# Altium project Board_Scale.PrjPcb
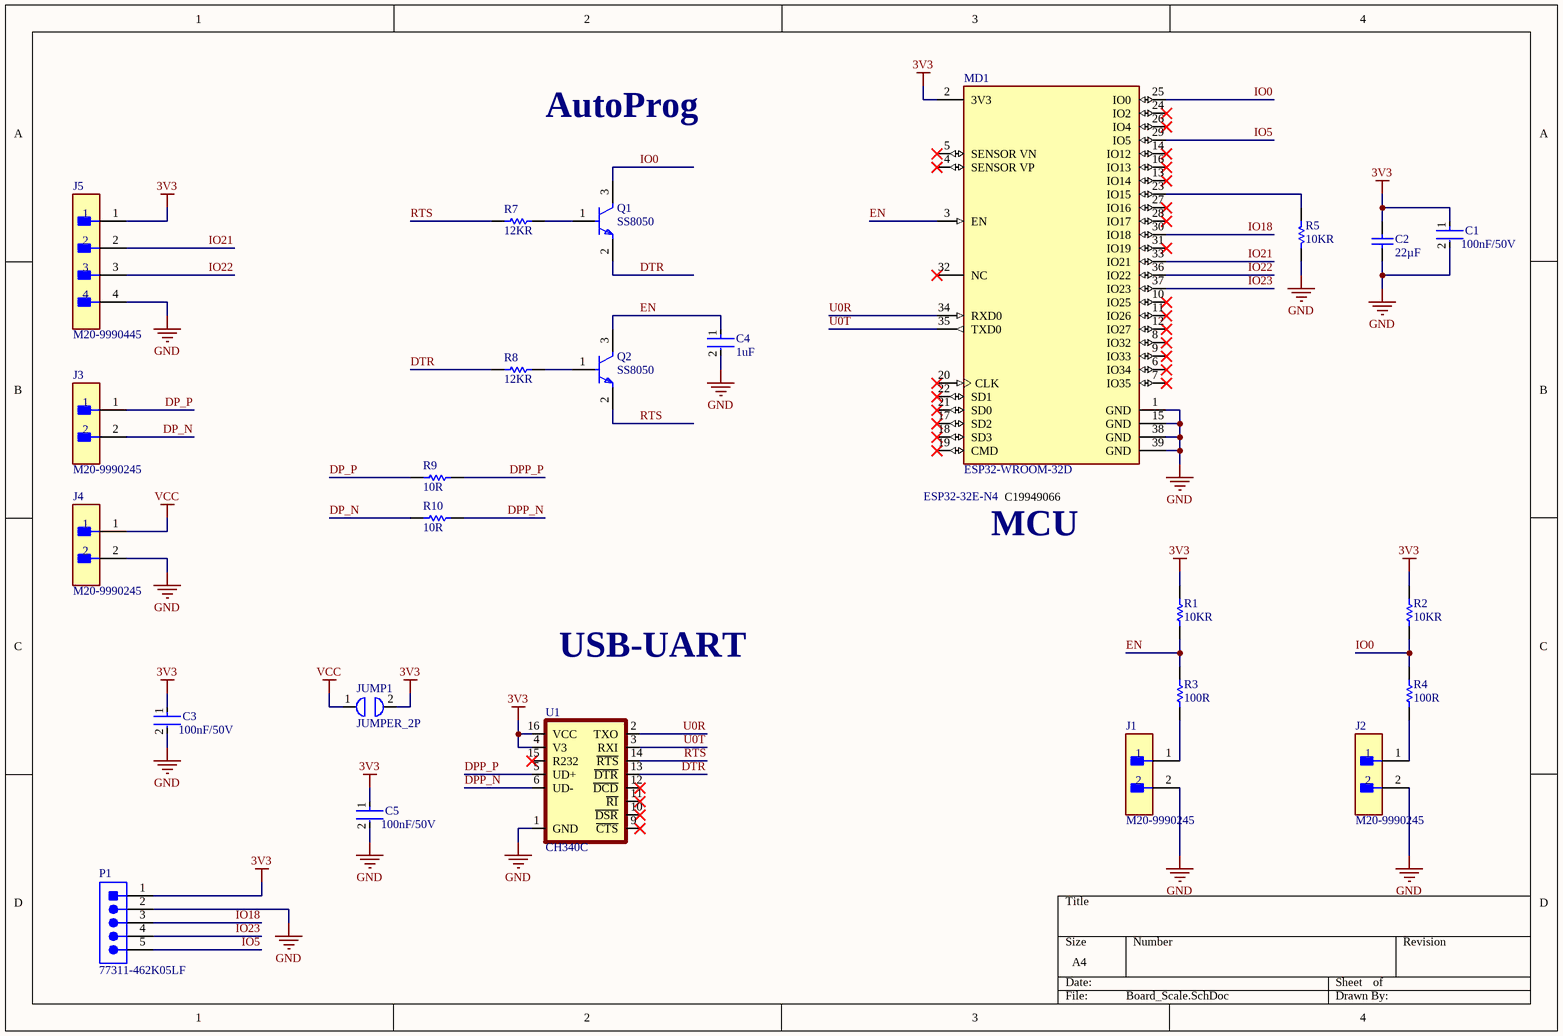
[diagram p0: Board_Scale.SchDoc]
1 sheet, 25 parts. Net scope: global (net labels, ports and power ports of the same name join across sheets).
Board file: Board_Scale.PcbDoc

## Sheet Board_Scale.SchDoc
size A4; SheetNumber: 1; SheetTotal: 1

### Parts
C1  100nF/50V  [FP-CC0603-DA-MFG]
C2  Capacitance: 22µF  [CAPC2013X140X45LL15T25]  (hidden comment: CL21A226MAQNNNE)
C3  100nF/50V  [FP-CC0603-DA-MFG]
C4  1uF  [FP-CL10-IPC_A]
C5  100nF/50V  [FP-CC0603-DA-MFG]
J1  M20-9990245  [FP-M20-9990245-MFG]
J2  M20-9990245  [FP-M20-9990245-MFG]
J3  M20-9990245  [FP-M20-9990245-MFG]
J4  M20-9990245  [FP-M20-9990245-MFG]
J5  M20-9990445  [FP-M20-9990445-MFG]
JUMP1  JUMPER_2P  [JUMPER_2P]
MD1  ESP32-WROOM-32D  [FP-ESP32-WROOM-32D-MFG]
P1  77311-462K05LF  [FCI-77311-5_V]
Q1  SS8050  [FP-SS8050-G-MFG]
Q2  SS8050  [FP-SS8050-G-MFG]
R1  10KR  [RESC1609X55X30LL15T15]
R2  10KR  [RESC1609X55X30LL15T15]
R3  100R  [RESC1608X55X30LL15T15]
R4  100R  [RESC1608X55X30LL15T15]
R5  10KR  [RESC1609X55X30LL15T15]
R7  12KR  [RESC1608X55X25NL10T15]
R8  12KR  [RESC1608X55X25NL10T15]
R9  10R  [RESC1608X55X25NL10T15]
R10  10R  [RESC1608X55X25NL10T15]
U1  CH340C  [SO016]

### Nets
3V3: C1.1 C2.2 C3.1 C5.1 J5.1 JUMP1.2 MD1.2(3V3) P1.1(DTR) R1.1 R2.1 U1.4(V3) U1.16(VCC)
GND: C1.2 C2.1 C3.2 C4.2 C5.2 J1.2 J2.2 J4.2 J5.4 MD1.1(GND) MD1.15(GND) MD1.38(GND) MD1.39(GND) P1.2(RXI) R5.2 U1.1(GND)
VCC: J4.1 JUMP1.1
DP_N: J3.2 R10.2
DP_P: J3.1 R9.2
DPP_N: R10.1 U1.6(UD-)
DPP_P: R9.1 U1.5(UD+)
DTR: Q1.2(E) R8.1 U1.13(~{DTR})
EN: C4.1 MD1.3(EN) Q2.3(C) R1.2 R3.2
IO0: MD1.25(IO0) Q1.3(C) R2.2 R4.2
IO5: MD1.29(IO5) P1.5(CTS)
IO18: MD1.30(IO18) P1.3(TXO)
IO21: J5.2 MD1.33(IO21)
IO22: J5.3 MD1.36(IO22)
IO23: MD1.37(IO23) P1.4(VCC)
RTS: Q2.2(E) R7.1 U1.14(~{RTS})
U0R: MD1.34(RXD0) U1.2(TXO)
U0T: MD1.35(TXD0) U1.3(RXI)
NetJ1_1: J1.1 R3.1
NetJ2_1: J2.1 R4.1
NetMD1_23: MD1.23(IO15) R5.1
NetQ1_1: Q1.1(B) R7.2
NetQ2_1: Q2.1(B) R8.2

Not connected (* = marked no-connect by the designer): MD1 4(SENSOR_VP)* 5(SENSOR_VN)* 6(IO34)* 7(IO35)* 8(IO32)* 9(IO33)* 10(IO25)* 11(IO26)* 12(IO27)* 13(IO14)* 14(IO12)* 16(IO13)* 17(SD2)* 18(SD3)* 19(CMD)* 20(CLK)* 21(SD0)* 22(SD1)* 24(IO2)* 26(IO4)* 27(IO16)* 28(IO17)* 31(IO19)* 32(NC)*; U1 9(~{CTS})* 10(~{DSR})* 11(~{RI})* 12(~{DCD})* 15(R232)*

### Notes on the sheet
- AutoProg
- (near MD1) ESP32-32E-N4
- (near MD1) C19949066
- MCU
- USB-UART

### Library data of the parts
C1 C3 C5 = CMP-2100-03601-2: CAP CER 0.1UF 50V X7R 0603; Manufacturer: YAGEO; Manufacturer Part Number: CC0603KRX7R9BB104; Material: Ceramic; Capacitance: 100 nF; Temperature Coefficient: 15%; Tolerance: 0.1; Value: 100 nF; Height: 0.9mm; Voltage: 50 V; ComponentLink2Description: Datasheet; Device Class L2: Capacitors; Temperature Range High: +125°C; Category: Cap; Footprint Url: http://www.yageo.com/exep/pages/download/literatures/UPY-C_GEN_24.pdf; ComponentLink2URL: http://www.yageo.com/documents/recent/UPY-GPHC_X7R_6.3V-to-50V_18.pdf; Package: CC0603-DA; Temperature: -55°C to +125°C; Voltage Rating: 50 V; Temperature Characteristic: X7R; Device Class L1: Passive Components; Temperature Range Low: -55°C; RoHS: TRUE; Automotive: No; Device Class L3: Ceramic Capacitors; Octopart: https://octopart.com/cc0603krx7r9bb104-yageo-42244635; Mouser Description: Multilayer Ceramic Capacitor, CC Series, 0.1 - F, - 10%, X7R, 50 V, 0603 [1608 Metric]; Lead Free: Yes; Digikey Description: CAP CER 0.1UF 50V X7R 0603; LCSC: C14663
C2 = CMP-2000-06104-1: Multi-layer Ceramic Capacitor, 22 uF, -55 to 85 degC, 2-Pin SMD (0805), RoHS, Tape and Reel; Manufacturer: Samsung Electro-Mechanics; Voltage - Rated: 25V; Other Names: 1276-2908-2; Featured Product: Multi-LayerCeramicCapacitors; Product Training Modules: HighCapMLCCFamily; Temperature Coefficient: X5R; Tolerance: ±20%; Online Catalog: CLSeries,HighCapacitance; Applications: GeneralPurpose; RoHS Information: MLCCRoHS2Compliance; Height - Seated (Max): -; Lead Style: -; Lead Spacing: -; Datasheet URL: http://datasheet.octopart.com/CL21A226MAQNNNE-Samsung-datasheet-48647558.pdf; Size / Dimension: 0.079"Lx0.049"W(2.00mmx1.25mm); Thickness (Max): 0.055"(1.40mm); Family: CeramicCapacitors; Package Description: 2-Pin Surface Mount Device, Body 2.0 x 1.25 mm; Datasheet Version: 07/2015; Packaging: Tape&Reel(TR); Manufacturer URL: http://www.samsungsem.com/global/index.jsp; Ratings: -; Package / Case: 0805(2012Metric); Standard Package: 2,000; Mounting Type: SurfaceMount,MLCC; Mounting Technology: SurfaceMount; Category: Capacitors; Package Reference: 0805; Series: CL; Features: -; Operating Temperature: -55°C~85°C; LCSC: C45783
C4 = CMP-13271-001457-1: Cap Ceramic 1uF 16V X5R ±10% Pad SMD 0603 +85°C T/R; Dielectric: X5R; Height: 0.8mm; Capacitance: 1uF; Mount: Surface Mount; Thickness: 0.035inch; Width: 0.031inch; Min Operating Temperature: -55°C; Contact Plating: Tin; Case Code (Imperial): 0603; Depth: 0.8mm; Length: 1.6mm; Max Operating Temperature: 85°C; Packaging: Tape and Reel; Tolerance: 10%; Radiation Hardening: No; Case/Package: 0603; Package Quantity: 1; Voltage Rating: 16V; Case Code (Metric): 1608; Voltage: 16V; Material: Ceramic; Lead Free: Lead Free; Voltage Rating (DC): 16V; LCSC: C1592
J1-J4 = CMP-15831-000105-1: CONN HEADER VERT 2POS 2.54MM; Working Voltage: 750V; Gender: Male; Number of Poles: 2; Current Rating: 3A; Mated Stacking Heights: 16.54mm; Contact Resistance: 25mR; Connector Type: Male Pin; Insulation Resistance: 10GR; Mating Cycles: 300; Voltage: 50V; Flammability Rating: UL94 V-0; Pitch: 2.54mm; Series: M20; Number of Contacts: 2; Height: 0.12inch; Min Operating Temperature: -40°C; Contact Finish - Mating: GOLD; Number of Positions: 2; Number of Rows: 1; Packaging: Bulk; Package Quantity: 1000; Voltage Rating (AC): 750V; Current: 3A; Mount: Through Hole; Case/Package: SIL; Orientation: Straight; Contact Shape: Square; Weight: 0.25lb; Radiation Hardening: No; Fastening Type: Pull; Length: 5.08mm; Depth: 2.54mm; Contact Mating Length: 0.24inch; Housing Material: Nylon; Reach SVHC Compliant: Yes; Insulation Material: Nylon; Color: Black; Width: 0.25inch; Insulation Color: Black; Contact Material: Brass; Contact Type: Male Pin; Termination: Solder; Max Operating Temperature: 105°C; Contact Plating: Gold; Housing Color: Black; Max Current Rating: 3A; Lead Pitch: 2.54mm
J5 = CMP-00671-05399696-1: M20-9990445 Conn Unshrouded Header HDR 4 POS 2.54mm Solder ST Thru-Hole Bulk/Loose; Insulation Resistance: 10GΩ; Connector Type: Male Pin; Voltage Rating (DC): 750V; Max Current Rating: 3A; Contact Resistance: 25mΩ; Number of Contacts: 4; Gender: Male; Color: Black; Height: 2.54mm; Contact Material: Brass, Bronze, Gold, Nickel; Orientation: Straight; Width: 12.7mm; Mount: Through Hole; Pitch: 2.54mm; Lead Pitch: 2.54mm; RoHS: Compliant; Max Operating Temperature: 105°C; Case/Package: SIL; NexarPartId: 5399696; Depth: 2.54mm; Length: 10.16mm; Current Rating: 3A; Contact Plating: Gold; Radiation Hardening: No; Contact Mating Length: 6.096mm; Voltage Rating (AC): 750V; Termination: Solder; REACH SVHC: No SVHC; Weight: 45.359237g; Number of Rows: 1; Min Operating Temperature: -40°C; Housing Material: Nylon; Housing Color: Black; Number of Positions: 4; Number of Pins: 4
MD1 = CMP-194065-000003-1: WIFI MODULE 32MBITS SPI FLASH; Manufacturer: Espressif Systems; Max Supply Voltage: 3.6V; Nominal Supply Current: 500mA; Max Frequency: 2484MHz; Number Of Adc Channels: 16; Number Of Gpio: 32; Interface: I2C,SPI,UART,Ethernet,I2S,Other; Data Rate: 150Mbits/s; Min Supply Voltage: 3V; Bandwidth: 72MHz; Sensitivity: -98dBm; Octopart: https://octopart.com/esp32-wroom-32d-espressif+systems-91040050; Package: ESP32-WROOM-32D; ComponentLink2URL: https://www.espressif.com/sites/default/files/documentation/esp32-wroom-32d_esp32-wroom-32u_datasheet_en.pdf; Lead Free: Yes; Category: UNK; Mouser Description: Wi-Fi/BT BLE Module ESP32-D0WD, SPI Flash, UART, P; Device Class L1: Integrated Circuits (ICs); RoHS: TRUE; Temperature Range Low: -40°C; ComponentLink2Description: Datasheet; Digikey Description: WIFI MODULE 32MBITS SPI FLASH; Height: 3.2mm; Temperature: -40°C to +85°C; Manufacturer Part Number: ESP32-WROOM-32D; Device Class L3: Transceivers; Device Class L2: RF Semiconductors and Devices; Temperature Range High: +85°C; Automotive: No; LCSC: C473012
P1 = CMP-1698-00006-1: Male Header, Pitch 2.54 mm, 1 x 5 Position, Height 16.24 mm, Tail Length 3.05 mm, / -65 to 125 degC, RoHS, Tape and Reel; Shielding: Shielded; Current Rating: 1 A; Gender: Female; ComponentLink2URL: http://portal.fciconnect.com/Comergent//fci/drawing/77311.pdf; ComponentLink1URL: http://portal.fciconnect.com/; ComponentLink2Description: Datasheet; Max Operating Temperature: 85degC; Package Quantity: 500; PackageDescription: Male Header, Pitch 2.54 mm, 1 x 5 Position, Height 16.24 mm, Tail Length 3.05 mm; ComponentLink1Description: Manufacturer URL; Min Operating Temperature: -25degC; Contact Material: Brass; PackageReference: 77311-5; RoHSCompliant: True; Packaging: Tape and Reel; DatasheetVersion: Rev. CK, 07/2016
Q1 Q2 = CMP-20235-000001-1: NPN TRANSISTOR 1.5A 40V SOT-23 R; Transition Frequency: 100MHz; Max Breakdown Voltage: 25V; Collector Emitter Voltage (VCEO): 400mV; Max Power Dissipation: 300mW; Max Collector Current: 1.5A; Case/Package: TO-236-3; Packaging: Tape and Reel; RoHS Compliant: Yes; Mount: Surface Mount; Collector Emitter Breakdown Voltage: 25V; LCSC: C181160
R1 R2 R5 = CMP-1012-00623-3: Chip Resistor, 10 KOhm, +/- 1%, 0.1 W, -55 to 155 degC, 0603 (1608 Metric), RoHS, Tape and Reel; Manufacturer: Panasonic; Voltage Rating: 75V; Case\/Package: 0603; Power Rating: 100mW; Resistance: 10KOhm; Temperature Coefficient: 100ppm\/degreesC; Number of Pins: 2; Package Reference: 603; Depth: 0.8mm; Mount: SurfaceMount; Package Description: 2-Pin Surface Mount Device, Body 1.6 x 0.85 mm; Datasheet Version: 02/2017; Length: 1.6mm; Lead Free: LeadFree; Height: 0.45mm; Number of Terminations: 2; Max Power Dissipation: 100mW; Min Operating Temperature: -55degC; Datasheet URL: https://industrial.panasonic.com/cdbs/www-data/pdf/RDA0000/AOA0000C304.pdf; Termination: SMD/SMT; Case Code (Metric): 1608; Case Code (Imperial): 0603; Tolerance: 1%; Max Operating Temperature: 155degC; RoHSCompliant: true; Voltage Rating (DC): 75V; Radiation Hardening: No; Packaging: TapeandReel; Composition: ThickFilm; Mounting Technology: SurfaceMount; Manufacturer URL: http://www.panasonic.com/; Width: 0.031inch; REACH SVHC: NoSVHC; Contact Plating: Tin; Military Standard: Not; Package Quantity: 1; LCSC: C25804
R3 R4 = CMP-2000-00179-1: Manufacturer: Panasonic; Part Number: ERJ-3EKF1000V; LCSC: C22775
R7 R8 = CMP-1659-00047-2: Chip Resistor, 12 KOhm, +/- 1%, 100 mW, -55 to 155 degC, 0603 (1608 Metric), RoHS, Tape and Reel; Resistance: 12 kohm; Power Rating: 100 mW; Voltage Rating (DC): 50 V; Case\Package: 0603; ComponentLink2URL: http://www.yageo.com/documents/recent/PYu-RC_Group_51_RoHS_L_04.pdf; Case Code (Imperial): 0603; ComponentLink2Description: Datasheet; Height: 0.45 mm; Case Code (Metric): 1608; RoHSCompliant: true; Max Operating Temperature: 155 degC; Width: 0.8 mm; Mount: Surface Mount; ComponentLink1URL: http://www.yageo.com/; Pins: 2; Tolerance: 1%; Min Operating Temperature: -55 degC; Length: 1.6 mm; PackageReference: 0603; REACH SVHC: No SVHC; PackageDescription: 2-Pin Surface Mount Device, Body 1.6 x 0.8 mm; Voltage Rating: 50 V; Packaging: Tape and Reel; Package Quantity: 5000; ComponentLink1Description: Manufacturer URL; DatasheetVersion: Rev. 4, 02/2016; LCSC: C22790
R9 R10 = CMP-1659-00008-4: Chip Resistor, 10 Ohm, +/- 1%, 0.1 W, -55 to 155 degC, 0603 (1608 Metric), RoHS, Tape and Reel; Manufacturer: Yageo; Voltage Rating: 50 V; PackageReference: 0603; ComponentLink3Description: Package Specification; Packaging: Tape and Reel; Max Operating Temperature: 155 degC; ComponentLink3URL: http://www.farnell.com/datasheets/443971.pdf; PackageDescription: 2-Pin Surface Mount Device, Body 1.6 x 0.8 mm; ComponentLink1URL: http://www.yageo.com/; Pins: 2; REACH SVHC: No SVHC; RoHSCompliant: true; ComponentLink2URL: http://www.yageo.com/documents/recent/PYu-RC_Group_51_RoHS_L_04.pdf; DatasheetVersion: Rev. 4, 02/2016; Mount: Surface Mount; Package Quantity: 200; Min Operating Temperature: -55 degC; Height: 0.45 mm; Mounting Technology: Surface Mount; ComponentLink1Description: Manufacturer URL; ComponentLink2Description: Datasheet; Length: 1.6 mm; LCSC: C22859
U1 = CH340C: Replacement for Brother P-Touch; MF: Olimex; SnapEDA_Link: https://www.snapeda.com/parts/CH340C/Olimex/view-part/?ref=snap; Package: None; LCSC: C7464026; MP: CH340C; Check_prices: https://www.snapeda.com/parts/CH340C/Olimex/view-part/?ref=eda